# EAGLE design ax12_control_board (EAGLE 6.1)
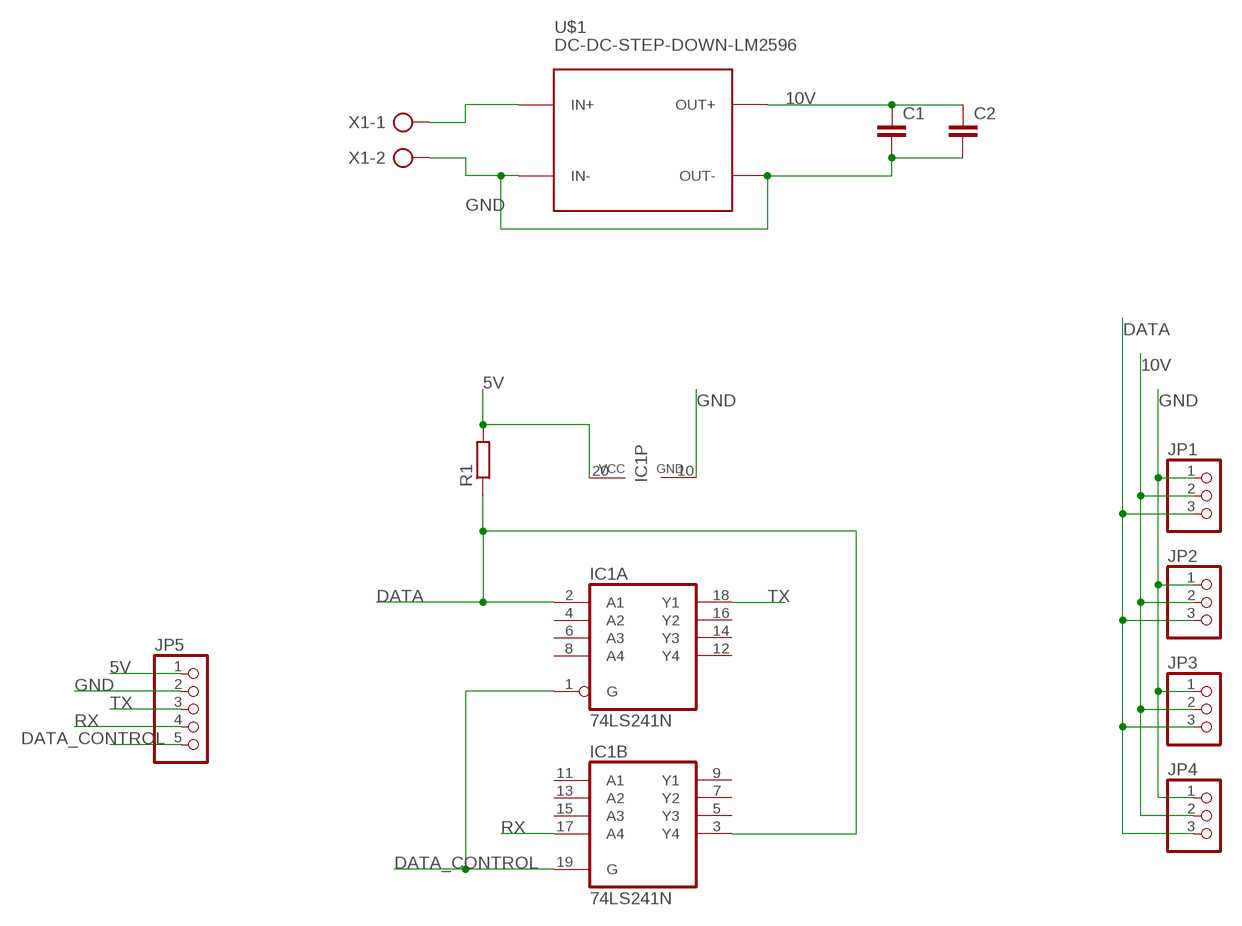
[diagram p0: schematic, sheet 1]

## Parts
C1  C-EU025-060X050  [C025-060X050]
C2  C-EU025-060X050  [C025-060X050]
IC1  74LS241N  [DIL20]
JP1  PINHD-1X3  [1X03]
JP2  PINHD-1X3  [1X03]
JP3  PINHD-1X3  [1X03]
JP4  PINHD-1X3  [1X03]
JP5  PINHD-1X5  [1X05]
R1  R-EU_0207/12  [0207/12]
U$1  DC-DC-STEP-DOWN-LM2596  [DC-DC-STEP-DOWN-LM2596]
X1  AK300/2  [AK300/2]

## Nets
5V: IC1.20(P:VCC) JP5.1 R1.2
10V: C1.1 C2.1 JP1.2 JP2.2 JP3.2 JP4.2 U$1.OUT+
DATA: IC1.2(A:A1) IC1.3(B:Y4) JP1.3 JP2.3 JP3.3 JP4.3 R1.1
DATA_CONTROL: IC1.1(A:G) IC1.19(B:G) JP5.5
GND: C1.2 C2.2 IC1.10(P:GND) JP1.1 JP2.1 JP3.1 JP4.1 JP5.2 U$1.IN- U$1.OUT- X1.2
N$1: U$1.IN+ X1.1
RX: IC1.17(B:A4) JP5.4
TX: IC1.18(A:Y1) JP5.3
Unconnected: IC1.4(A:A2) IC1.5(B:Y3) IC1.6(A:A3) IC1.7(B:Y2) IC1.8(A:A4) IC1.9(B:Y1) IC1.11(B:A1) IC1.12(A:Y4) IC1.13(B:A2) IC1.14(A:Y3) IC1.15(B:A3) IC1.16(A:Y2)

## Library data of the parts
C1 C2 = rcl:C-EU: CAPACITOR, European symbol
IC1 = 74xx-eu:74*241: Octal BUFFER and LINE DRIVER, 3-state
JP1-JP4 = pinhead:PINHD-1X3: PIN HEADER
JP5 = pinhead:PINHD-1X5: PIN HEADER
R1 = rcl:R-EU_: RESISTOR, European symbol
U$1 = diy-modules:DC-DC-STEP-DOWN-LM2596: DC/DC Step-Down Regulator based on LM2596-ADJ chip LM2596 datasheet available here: http://www.ti.com/lit/ds/symlink/lm2596.pdf Click here to find device on ebay.com <http://www.ebay.com/sch/lm2596+power+regulator>
X1 = con-ptr500:AK300/2: CONNECTOR; OC_FARNELL: unknown; OC_NEWARK: unknown

## Board
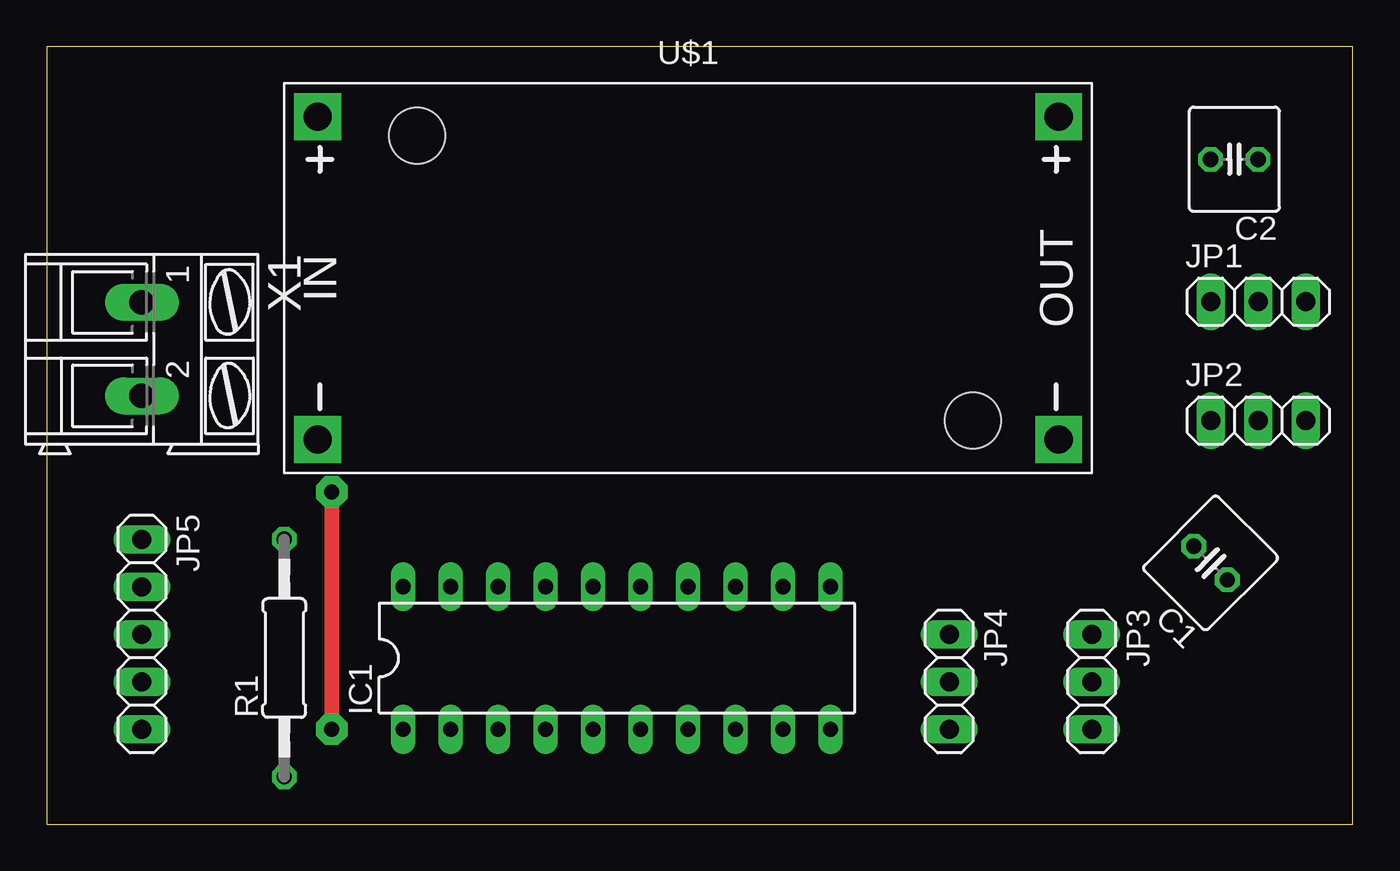
[diagram p1: board, top side]
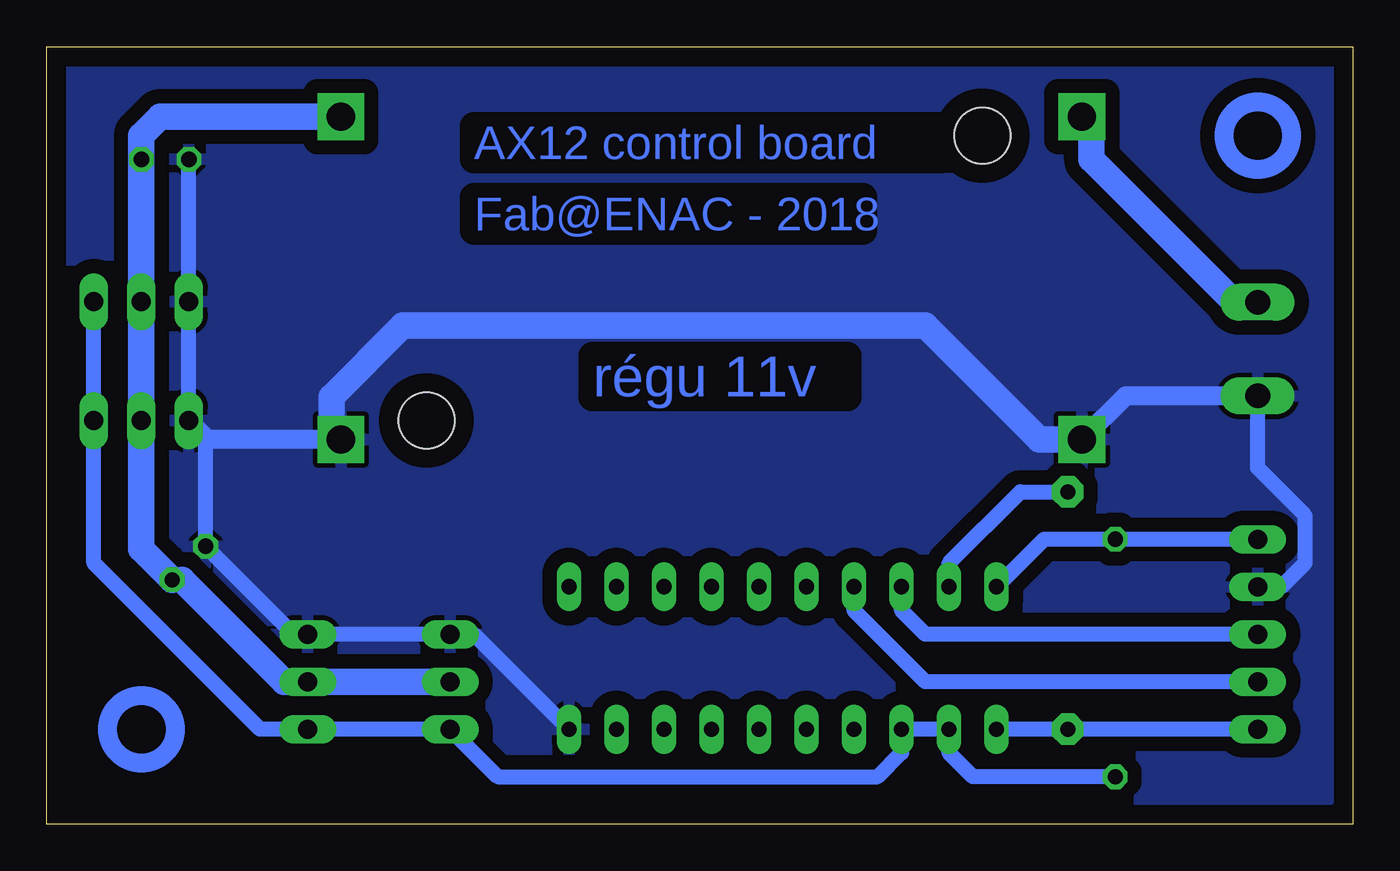
[diagram p2: board, bottom side, seen from below]

Size 69.83 x 41.58 mm. Coordinates in mm from the lower left corner, seen from the top.
Outline: 0,0 69.83,0 69.83,41.58 0,41.58 0,0
Copper layers (1*16): Top 0.035mm / dielectric 1.5mm / Bottom 0.035mm
Design rules: minimum track width 10mil, minimum drill 24mil, track to track 30mil, track to pad 30mil, pad to pad 8mil, via to via 8mil, smd to smd 8mil, copper to edge 40mil, drill to drill 8mil, minimum pad ring 10mil, minimum via ring 8mil, stop-mask expansion 4mil, vias tented up to drill 0mil, thermal gap 10mil

### Footprints (pad centres in the part's own frame; a part is rotated, then mirrored left to right if it is on the bottom)
C025-060X050 = drill 0.813 octagon: 1 -1.27,0; 2 1.27,0
DIL20 = drill 0.813 long: 1 -11.43,-3.81; 2 -8.89,-3.81; 3 -6.35,-3.81; 4 -3.81,-3.81; 5 -1.27,-3.81; 6 1.27,-3.81; 7 3.81,-3.81; 8 6.35,-3.81; 9 8.89,-3.81; 10 11.43,-3.81; 11 11.43,3.81; 12 8.89,3.81; 13 6.35,3.81; 14 3.81,3.81; 15 1.27,3.81; 16 -1.27,3.81; 17 -3.81,3.81; 18 -6.35,3.81; 19 -8.89,3.81; 20 -11.43,3.81
1X03 = drill 1.016 long: 1 -2.54,0; 2 0,0; 3 2.54,0
1X05 = drill 1.016 long: 1 -5.08,0; 2 -2.54,0; 3 0,0; 4 2.54,0; 5 5.08,0
0207/12 = drill 0.813 octagon: 1 -6.35,0; 2 6.35,0
DC-DC-STEP-DOWN-LM2596 = drill 1.5 pad 2.5 square: IN+ -19.812,8.636; IN- -19.812,-8.636; OUT+ 19.812,8.636; OUT- 19.812,-8.636 | hole 3: -14.478,7.62; 15.24,-7.62
AK300/2 = drill 1.321 long: 1 -2.515,0; 2 2.489,0

### Placement (x,y rotation side)
C1  62.23,13.97 135 top
C2  63.5,35.56 180 top
IC1  30.48,8.89 0 top
JP1  64.77,27.94 0 top
JP2  64.77,21.59 0 top
JP3  55.88,7.62 270 top
JP4  48.26,7.62 270 top
JP5  5.08,10.16 270 top
R1  12.7,8.89 90 top
U$1  34.29,29.21 0 top
X1  5.08,25.4 270 top

### Tracks (layer width: path | path; a pad name or v marks a point on that pad's centre or on a via)
5V
  Bottom 0.813: JP5.1 R1.2 16.51,15.24 IC1.20
10V
  Bottom 1.016: C1.1 62.6,13.07
  Bottom 1.422: JP4.2 JP3.2 57.15,7.62 62.6,13.07 | U$1.OUT+ 63.75,37.85 64.77,36.83 C2.1 JP1.2 JP2.2 64.77,14.71 C1.1
DATA
  Bottom 0.813: R1.1 20.32,2.54 21.59,3.81 IC1.2 IC1.3 24.13,3.81 25.4,2.54 45.72,2.54 JP4.3 JP3.3 58.42,5.08 67.31,13.97 JP2.3 JP1.3
DATA_CONTROL  (via drill 0.8 pad 1.68)
  Top 0.813: v15.24,17.78 v15.24,5.08
  Bottom 0.813: IC1.19 21.59,13.97 17.78,17.78 v15.24,17.78 | IC1.1 v15.24,5.08 JP5.5
GND
  Bottom 0.813: C2.2 JP1.1 JP2.1 61.33,20.69 C1.2 56.62,10.16 JP3.1 JP4.1 46.99,10.16 IC1.10 | JP5.2 3.81,12.7 2.54,13.97 2.54,16.51 5.08,19.05 X1.2
  Bottom 1.016: X1.2 12.14,22.91 U$1.IN- | U$1.OUT- 61.21,20.57 JP2.1
  Bottom 1.422: U$1.IN- 16.76,20.57 22.86,26.67 50.8,26.67 54.61,22.86 54.61,20.32
  pour Bottom: 1.27,1.27 1.27,40.64 68.58,40.64 68.58,1.27
N$1
  Bottom 1.422: X1.1 6.33,27.91 13.97,35.56 13.97,37.34 U$1.IN+
RX
  Bottom 0.813: JP5.4 22.86,7.62 26.67,11.43 IC1.17
TX
  Bottom 0.813: JP5.3 22.86,10.16 24.13,11.43 IC1.18
(copper drawn outside any net)
  shapes: Bottom circle x2

### Text on the board
Bottom: AX12 control board | Fab@ENAC - 2018 | régu 11v